# EAGLE board 12ChannelEMG (EAGLE 6.3), part 1 of 2
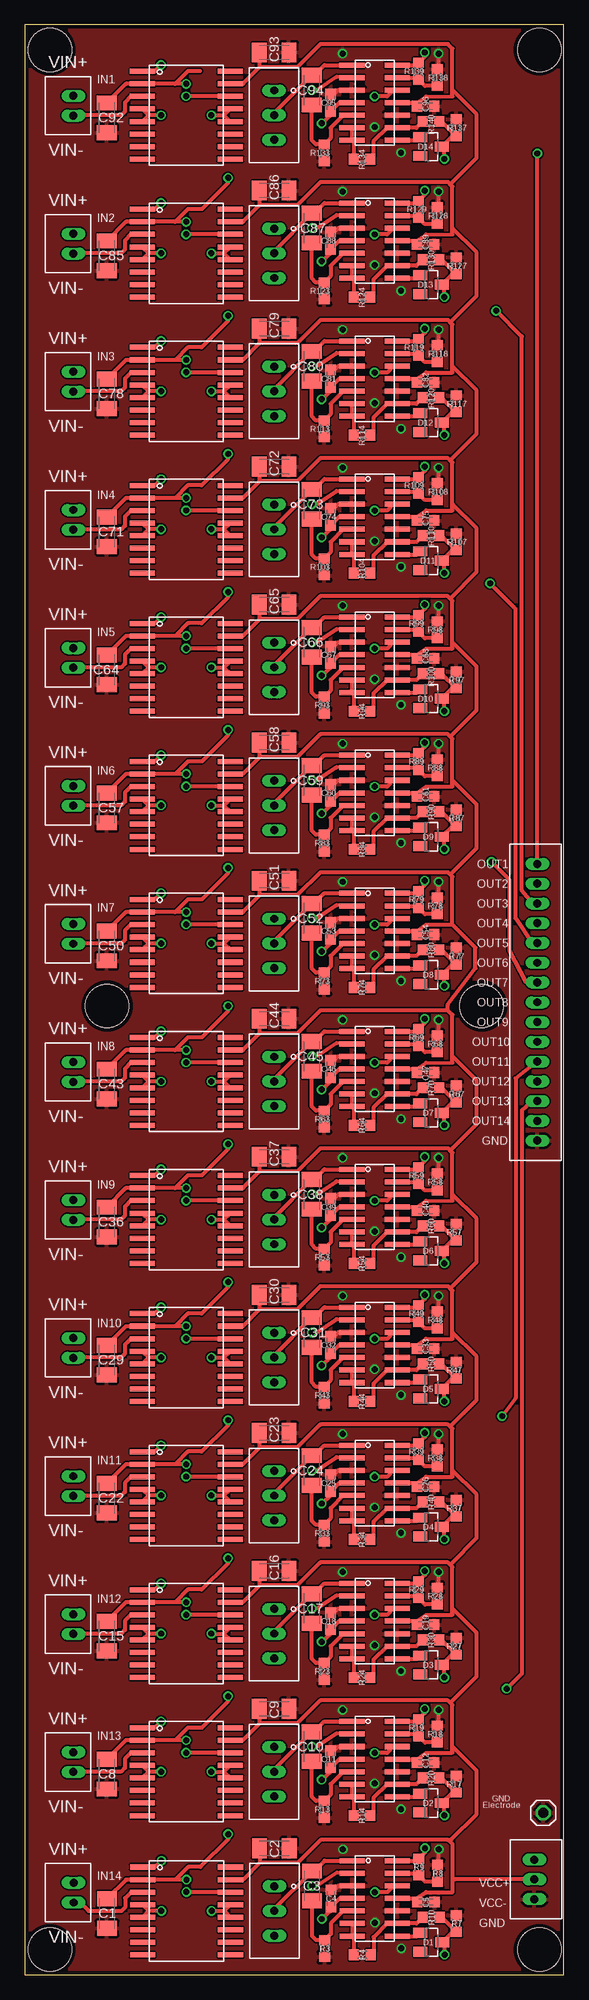
[diagram p2: board, top side]
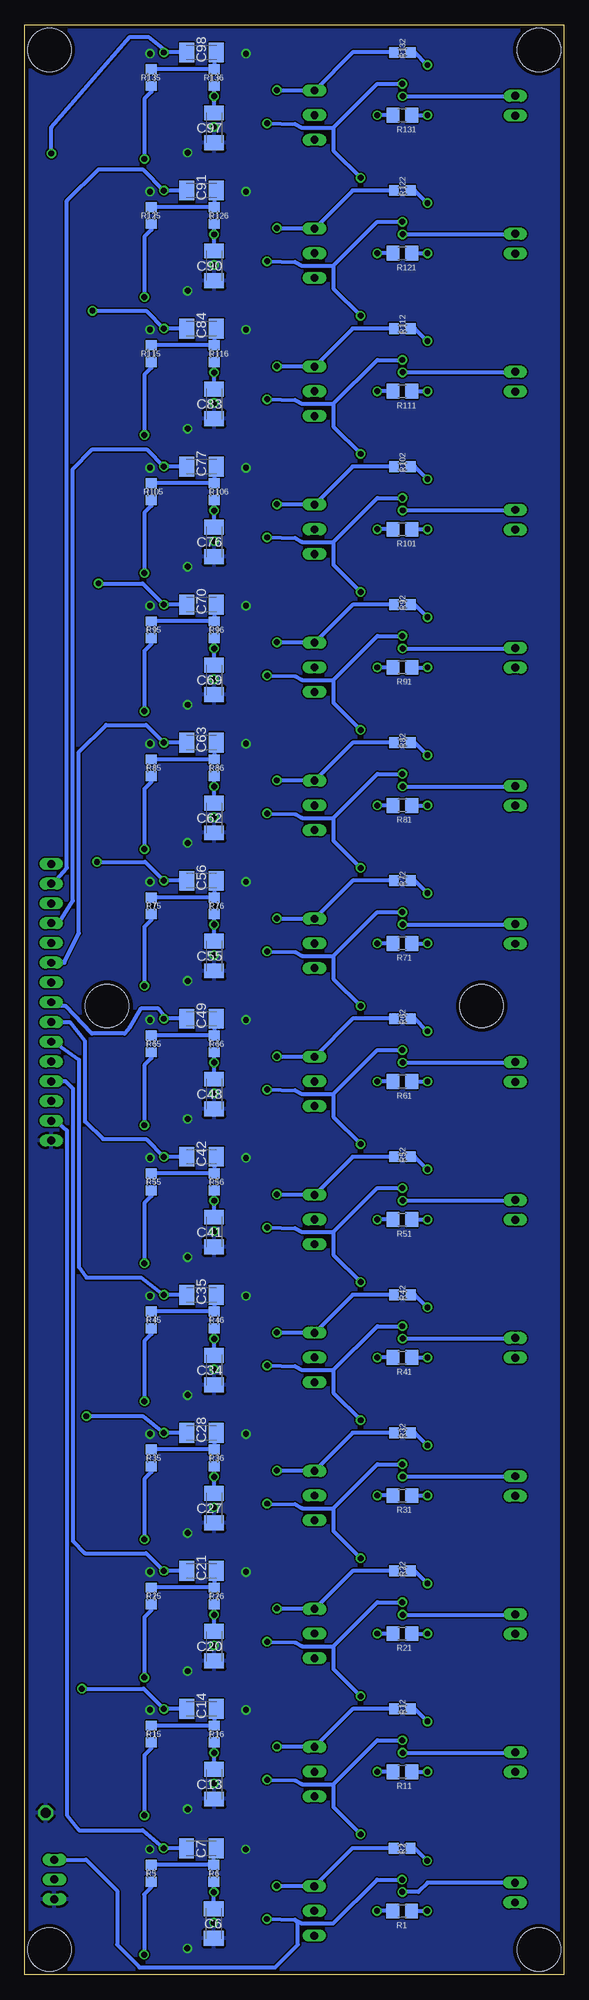
[diagram p3: board, bottom side, seen from below]

Size 54.56 x 197.36 mm. Coordinates in mm from the lower left corner, seen from the top.
Outline: 0,0 54.56,0 54.56,197.36 0,197.36 0,0
Copper layers (1*16): Top 0.0356mm / dielectric 1.5011mm / Bottom 0.0356mm
Design rules "LaenPCBOrder *": minimum track width 6mil, minimum drill 13mil, track to track 6mil, track to pad 6mil, pad to pad 6mil, via to via 6mil, smd to smd 6mil, copper to edge 15mil, drill to drill 6mil, minimum pad ring 7mil, minimum via ring 7mil, stop-mask expansion 4mil, vias tented up to drill 0mil, thermal gap 10mil
Holes 4.39 mm at 2.54,194.82 52.07,194.82 52.07,2.54 2.54,2.54 8.33,98.04 46.23,98.04

## Footprints (pad centres in the part's own frame; a part is rotated, then mirrored left to right if it is on the bottom)
C1206K = smd 1.5 x 2: 1 -1.5,0; 2 1.5,0
C0603K = smd 1.05 x 1.08: 1 -0.875,0; 2 0.875,0
SOT23 = smd 1 x 1.4: 1 -0.95,-1.1; 2 0.95,-1.1; 3 0,1.1
1X01 = drill 1.016 octagon: 1 0,0
R0805 = smd 1.3 x 1.5: 1 -0.95,0; 2 0.95,0
R0603 = smd 1 x 1.1: 1 -0.85,0; 2 0.85,0
SOIC167.5MM = smd 2.54 x 0.508: 1 -4.445,4.445; 2 -4.445,3.175; 3 -4.445,1.905; 4 -4.445,0.635; 5 -4.445,-0.635; 6 -4.445,-1.905; 7 -4.445,-3.175; 8 -4.445,-4.445; 9 4.445,-4.445; 10 4.445,-3.175; 11 4.445,-1.905; 12 4.445,-0.635; 13 4.445,0.635; 14 4.445,1.905; 15 4.445,3.175; 16 4.445,4.445
SOIC14 = smd 2.54 x 0.508: 1 -2.286,3.81; 2 -2.286,2.54; 3 -2.286,1.27; 4 -2.286,0; 5 -2.286,-1.27; 6 -2.286,-2.54; 7 -2.286,-3.81; 8 2.286,-3.81; 9 2.286,-2.54; 10 2.286,-1.27; 11 2.286,0; 12 2.286,1.27; 13 2.286,2.54; 14 2.286,3.81
PV36W = drill 0.8 long: 1 -2.5,0; 2 0,0; 3 2.5,0
2PIN = drill 0.8 long: 1 0,1; 2 0,-1
3PIN = drill 0.8 long: 1 0,2; 2 0,0; 3 0,-2
15PIN = drill 0.8 long: 1 0,14; 2 0,12; 3 0,10; 4 0,8; 5 0,6; 6 0,4; 7 0,2; 8 0,0; 9 0,-2; 10 0,-4; 11 0,-6; 12 0,-8; 13 0,-10; 14 0,-12; 15 0,-14

## Placement (x,y rotation side)
C1  0.1uF  [C1206K]  8.33,6.2 270 top
C2  0.1uF  [C1206K]  25.26,12.81 0 top
C3  3.3uF  [C1206K]  29.07,9 270 top
C4  0.22uF  [C0603K]  30.98,7.73 90 top
C5  0.22uF  [C0603K]  40.59,7.37 0 top
C6  0.1uF  [C1206K]  35.42,5.19 270 bottom
C7  0.1uF  [C1206K]  36.69,12.81 180 bottom
C8  0.1uF  [C1206K]  8.3,20.3 270 top
C9  0.1uF  [C1206K]  25.24,26.91 0 top
C10  3.3uF  [C1206K]  29.05,23.1 270 top
C11  0.22uF  [C0603K]  30.95,21.83 90 top
C12  0.22uF  [C0603K]  40.57,21.46 0 top
C13  0.1uF  [C1206K]  35.4,19.29 270 bottom
C14  0.1uF  [C1206K]  36.67,26.91 180 bottom
C15  0.1uF  [C1206K]  8.3,34.27 270 top
C16  0.1uF  [C1206K]  25.24,40.88 0 top
C17  3.3uF  [C1206K]  29.05,37.07 270 top
C18  0.22uF  [C0603K]  30.95,35.8 90 top
C19  0.22uF  [C0603K]  40.57,35.43 0 top
C20  0.1uF  [C1206K]  35.4,33.26 270 bottom
C21  0.1uF  [C1206K]  36.67,40.88 180 bottom
C22  0.1uF  [C1206K]  8.3,48.24 270 top
C23  0.1uF  [C1206K]  25.24,54.85 0 top
C24  3.3uF  [C1206K]  29.05,51.04 270 top
C25  0.22uF  [C0603K]  30.95,49.77 90 top
C26  0.22uF  [C0603K]  40.57,49.4 0 top
C27  0.1uF  [C1206K]  35.4,47.23 270 bottom
C28  0.1uF  [C1206K]  36.67,54.85 180 bottom
C29  0.1uF  [C1206K]  8.3,62.21 270 top
C30  0.1uF  [C1206K]  25.24,68.82 0 top
C31  3.3uF  [C1206K]  29.05,65.01 270 top
C32  0.22uF  [C0603K]  30.95,63.74 90 top
C33  0.22uF  [C0603K]  40.57,63.37 0 top
C34  0.1uF  [C1206K]  35.4,61.2 270 bottom
C35  0.1uF  [C1206K]  36.67,68.82 180 bottom
C36  0.1uF  [C1206K]  8.3,76.18 270 top
C37  0.1uF  [C1206K]  25.24,82.79 0 top
C38  3.3uF  [C1206K]  29.05,78.98 270 top
C39  0.22uF  [C0603K]  30.95,77.71 90 top
C40  0.22uF  [C0603K]  40.57,77.34 0 top
C41  0.1uF  [C1206K]  35.4,75.17 270 bottom
C42  0.1uF  [C1206K]  36.67,82.79 180 bottom
C43  0.1uF  [C1206K]  8.3,90.15 270 top
C44  0.1uF  [C1206K]  25.24,96.76 0 top
C45  3.3uF  [C1206K]  29.05,92.95 270 top
C46  0.22uF  [C0603K]  30.95,91.68 90 top
C47  0.22uF  [C0603K]  40.57,91.31 0 top
C48  0.1uF  [C1206K]  35.4,89.14 270 bottom
C49  0.1uF  [C1206K]  36.67,96.76 180 bottom
C50  0.1uF  [C1206K]  8.3,104.12 270 top
C51  0.1uF  [C1206K]  25.24,110.73 0 top
C52  3.3uF  [C1206K]  29.05,106.92 270 top
C53  0.22uF  [C0603K]  30.95,105.65 90 top
C54  0.22uF  [C0603K]  40.57,105.28 0 top
C55  0.1uF  [C1206K]  35.4,103.11 270 bottom
C56  0.1uF  [C1206K]  36.67,110.73 180 bottom
C57  0.1uF  [C1206K]  8.3,118.09 270 top
C58  0.1uF  [C1206K]  25.24,124.7 0 top
C59  3.3uF  [C1206K]  29.05,120.89 270 top
C60  0.22uF  [C0603K]  30.95,119.62 90 top
C61  0.22uF  [C0603K]  40.57,119.25 0 top
C62  0.1uF  [C1206K]  35.4,117.08 270 bottom
C63  0.1uF  [C1206K]  36.67,124.7 180 bottom
C64  0.1uF  [C1206K]  8.3,132.06 270 top
C65  0.1uF  [C1206K]  25.24,138.67 0 top
C66  3.3uF  [C1206K]  29.05,134.86 270 top
C67  0.22uF  [C0603K]  30.95,133.59 90 top
C68  0.22uF  [C0603K]  40.57,133.22 0 top
C69  0.1uF  [C1206K]  35.4,131.05 270 bottom
C70  0.1uF  [C1206K]  36.67,138.67 180 bottom
C71  0.1uF  [C1206K]  8.3,146.03 270 top
C72  0.1uF  [C1206K]  25.24,152.64 0 top
C73  3.3uF  [C1206K]  29.05,148.83 270 top
C74  0.22uF  [C0603K]  30.95,147.56 90 top
C75  0.22uF  [C0603K]  40.57,147.19 0 top
C76  0.1uF  [C1206K]  35.4,145.02 270 bottom
C77  0.1uF  [C1206K]  36.67,152.64 180 bottom
C78  0.1uF  [C1206K]  8.3,160 270 top
C79  0.1uF  [C1206K]  25.24,166.61 0 top
C80  3.3uF  [C1206K]  29.05,162.8 270 top
C81  0.22uF  [C0603K]  30.95,161.53 90 top
C82  0.22uF  [C0603K]  40.57,161.16 0 top
C83  0.1uF  [C1206K]  35.4,158.99 270 bottom
C84  0.1uF  [C1206K]  36.67,166.61 180 bottom
C85  0.1uF  [C1206K]  8.3,173.97 270 top
C86  0.1uF  [C1206K]  25.24,180.58 0 top
C87  3.3uF  [C1206K]  29.05,176.77 270 top
C88  0.22uF  [C0603K]  30.95,175.5 90 top
C89  0.22uF  [C0603K]  40.57,175.13 0 top
C90  0.1uF  [C1206K]  35.4,172.96 270 bottom
C91  0.1uF  [C1206K]  36.67,180.58 180 bottom
C92  0.1uF  [C1206K]  8.3,187.94 270 top
C93  0.1uF  [C1206K]  25.24,194.55 0 top
C94  3.3uF  [C1206K]  29.05,190.74 270 top
C95  0.22uF  [C0603K]  30.95,189.47 90 top
C96  0.22uF  [C0603K]  40.57,189.1 0 top
C97  0.1uF  [C1206K]  35.4,186.93 270 bottom
C98  0.1uF  [C1206K]  36.67,194.55 180 bottom
D1  BAT54  [SOT23]  41.14,3.29 270 top
D2  BAT54  [SOT23]  41.11,17.38 270 top
D3  BAT54  [SOT23]  41.11,31.35 270 top
D4  BAT54  [SOT23]  41.11,45.32 270 top
D5  BAT54  [SOT23]  41.11,59.29 270 top
D6  BAT54  [SOT23]  41.11,73.26 270 top
D7  BAT54  [SOT23]  41.11,87.23 270 top
D8  BAT54  [SOT23]  41.11,101.2 270 top
D9  BAT54  [SOT23]  41.11,115.17 270 top
D10  BAT54  [SOT23]  41.11,129.14 270 top
D11  BAT54  [SOT23]  41.11,143.11 270 top
D12  BAT54  [SOT23]  41.11,157.08 270 top
D13  BAT54  [SOT23]  41.11,171.05 270 top
D14  BAT54  [SOT23]  41.11,185.02 270 top
GND  GND  [1X01]  52.45,16.38 0 top
R1  50k  [R0805]  16.37,6.46 180 bottom
R2  100  [R0603]  16.37,12.81 180 bottom
R3  10k  [R0603]  30.34,2.65 90 top
R4  200  [R0603]  34.15,2.02 0 top
R5  82k  [R0603]  41.77,10.27 90 bottom
R6  82k  [R0603]  35.42,10.27 90 bottom
R7  300  [R0603]  43.68,5.19 90 top
R8  100k  [R0603]  41.77,10.27 90 top
R9  56k  [R0603]  39.87,10.91 90 top
R10  100  [R0603]  41.14,5.83 0 top
R11  50k  [R0805]  16.35,20.56 180 bottom
R12  100  [R0603]  16.35,26.91 180 bottom
R13  10k  [R0603]  30.32,16.75 90 top
R14  200  [R0603]  34.13,16.11 0 top
R15  82k  [R0603]  41.75,24.37 90 bottom
R16  82k  [R0603]  35.4,24.37 90 bottom
R17  300  [R0603]  43.65,19.29 90 top
R18  100k  [R0603]  41.75,24.37 90 top
R19  56k  [R0603]  39.84,25 90 top
R20  100  [R0603]  41.11,19.92 0 top
R21  50k  [R0805]  16.35,34.53 180 bottom
R22  100  [R0603]  16.35,40.88 180 bottom
R23  10k  [R0603]  30.32,30.72 90 top
R24  200  [R0603]  34.13,30.08 0 top
R25  82k  [R0603]  41.75,38.34 90 bottom
R26  82k  [R0603]  35.4,38.34 90 bottom
R27  300  [R0603]  43.65,33.26 90 top
R28  100k  [R0603]  41.75,38.34 90 top
R29  56k  [R0603]  39.84,38.97 90 top
R30  100  [R0603]  41.11,33.89 0 top
R31  50k  [R0805]  16.35,48.5 180 bottom
R32  100  [R0603]  16.35,54.85 180 bottom
R33  10k  [R0603]  30.32,44.69 90 top
R34  200  [R0603]  34.13,44.05 0 top
R35  82k  [R0603]  41.75,52.31 90 bottom
R36  82k  [R0603]  35.4,52.31 90 bottom
R37  300  [R0603]  43.65,47.23 90 top
R38  100k  [R0603]  41.75,52.31 90 top
R39  56k  [R0603]  39.84,52.94 90 top
R40  100  [R0603]  41.11,47.86 0 top
R41  50k  [R0805]  16.35,62.47 180 bottom
R42  100  [R0603]  16.35,68.82 180 bottom
R43  10k  [R0603]  30.32,58.66 90 top
R44  200  [R0603]  34.13,58.02 0 top
R45  82k  [R0603]  41.75,66.28 90 bottom
R46  82k  [R0603]  35.4,66.28 90 bottom
R47  300  [R0603]  43.65,61.2 90 top
R48  100k  [R0603]  41.75,66.28 90 top
R49  56k  [R0603]  39.84,66.91 90 top
R50  100  [R0603]  41.11,61.83 0 top
R51  50k  [R0805]  16.35,76.44 180 bottom
R52  100  [R0603]  16.35,82.79 180 bottom
R53  10k  [R0603]  30.32,72.63 90 top
R54  200  [R0603]  34.13,71.99 0 top
R55  82k  [R0603]  41.75,80.25 90 bottom
R56  82k  [R0603]  35.4,80.25 90 bottom
R57  300  [R0603]  43.65,75.17 90 top
R58  100k  [R0603]  41.75,80.25 90 top
R59  56k  [R0603]  39.84,80.88 90 top
R60  100  [R0603]  41.11,75.8 0 top
R61  50k  [R0805]  16.35,90.41 180 bottom
R62  100  [R0603]  16.35,96.76 180 bottom
R63  10k  [R0603]  30.32,86.6 90 top
R64  200  [R0603]  34.13,85.96 0 top
R65  82k  [R0603]  41.75,94.22 90 bottom
R66  82k  [R0603]  35.4,94.22 90 bottom
R67  300  [R0603]  43.65,89.14 90 top
R68  100k  [R0603]  41.75,94.22 90 top
R69  56k  [R0603]  39.84,94.85 90 top
R70  100  [R0603]  41.11,89.77 0 top
R71  50k  [R0805]  16.35,104.38 180 bottom
R72  100  [R0603]  16.35,110.73 180 bottom
R73  10k  [R0603]  30.32,100.57 90 top
R74  200  [R0603]  34.13,99.93 0 top
R75  82k  [R0603]  41.75,108.19 90 bottom
R76  82k  [R0603]  35.4,108.19 90 bottom
R77  300  [R0603]  43.65,103.11 90 top
R78  100k  [R0603]  41.75,108.19 90 top
R79  56k  [R0603]  39.84,108.82 90 top
R80  100  [R0603]  41.11,103.74 0 top
R81  50k  [R0805]  16.35,118.35 180 bottom
R82  100  [R0603]  16.35,124.7 180 bottom
R83  10k  [R0603]  30.32,114.54 90 top
R84  200  [R0603]  34.13,113.9 0 top
R85  82k  [R0603]  41.75,122.16 90 bottom
R86  82k  [R0603]  35.4,122.16 90 bottom
R87  300  [R0603]  43.65,117.08 90 top
R88  100k  [R0603]  41.75,122.16 90 top
R89  56k  [R0603]  39.84,122.79 90 top
R90  100  [R0603]  41.11,117.71 0 top
R91  50k  [R0805]  16.35,132.32 180 bottom
R92  100  [R0603]  16.35,138.67 180 bottom
R93  10k  [R0603]  30.32,128.51 90 top
R94  200  [R0603]  34.13,127.87 0 top
R95  82k  [R0603]  41.75,136.13 90 bottom
R96  82k  [R0603]  35.4,136.13 90 bottom
R97  300  [R0603]  43.65,131.05 90 top
R98  100k  [R0603]  41.75,136.13 90 top
R99  56k  [R0603]  39.84,136.76 90 top
R100  100  [R0603]  41.11,131.68 0 top
R101  50k  [R0805]  16.35,146.29 180 bottom
R102  100  [R0603]  16.35,152.64 180 bottom
R103  10k  [R0603]  30.32,142.48 90 top
R104  200  [R0603]  34.13,141.84 0 top
R105  82k  [R0603]  41.75,150.1 90 bottom
R106  82k  [R0603]  35.4,150.1 90 bottom
R107  300  [R0603]  43.65,145.02 90 top
R108  100k  [R0603]  41.75,150.1 90 top
R109  56k  [R0603]  39.84,150.73 90 top
R110  100  [R0603]  41.11,145.65 0 top
R111  50k  [R0805]  16.35,160.26 180 bottom
R112  100  [R0603]  16.35,166.61 180 bottom
R113  10k  [R0603]  30.32,156.45 90 top
R114  200  [R0603]  34.13,155.81 0 top
R115  82k  [R0603]  41.75,164.07 90 bottom
R116  82k  [R0603]  35.4,164.07 90 bottom
R117  300  [R0603]  43.65,158.99 90 top
R118  100k  [R0603]  41.75,164.07 90 top
R119  56k  [R0603]  39.84,164.7 90 top
R120  100  [R0603]  41.11,159.62 0 top
R121  50k  [R0805]  16.35,174.23 180 bottom
R122  100  [R0603]  16.35,180.58 180 bottom
R123  10k  [R0603]  30.32,170.42 90 top
R124  200  [R0603]  34.13,169.78 0 top
R125  82k  [R0603]  41.75,178.04 90 bottom
R126  82k  [R0603]  35.4,178.04 90 bottom
R127  300  [R0603]  43.65,172.96 90 top
R128  100k  [R0603]  41.75,178.04 90 top
R129  56k  [R0603]  39.84,178.67 90 top
R130  100  [R0603]  41.11,173.59 0 top
R131  50k  [R0805]  16.35,188.2 180 bottom
R132  100  [R0603]  16.35,194.55 180 bottom
R133  10k  [R0603]  30.32,184.39 90 top
R134  200  [R0603]  34.13,183.75 0 top
R135  82k  [R0603]  41.75,192.01 90 bottom
R136  82k  [R0603]  35.4,192.01 90 bottom
R137  300  [R0603]  43.65,186.93 90 top
R138  100k  [R0603]  41.75,192.01 90 top
R139  56k  [R0603]  39.84,192.64 90 top
R140  100  [R0603]  41.11,187.56 0 top
U$1  INA101KU  [SOIC167.5MM]  16.37,6.46 0 top
U$2  LMC6492  [SOIC14]  35.42,7.73 0 top
U$3  PV36504  [PV36W]  25.26,6.46 270 top
U$4  INA101KU  [SOIC167.5MM]  16.35,20.56 0 top
U$5  LMC6492  [SOIC14]  35.4,21.83 0 top
U$6  PV36504  [PV36W]  25.24,20.56 270 top
U$7  2PIN  [2PIN]  4.93,21.53 0 top
U$8  INA101KU  [SOIC167.5MM]  16.35,34.53 0 top
U$9  LMC6492  [SOIC14]  35.4,35.8 0 top
U$10  2PIN  [2PIN]  4.95,8.32 0 top
U$11  PV36504  [PV36W]  25.24,34.53 270 top
U$12  2PIN  [2PIN]  4.93,35.5 0 top
U$13  INA101KU  [SOIC167.5MM]  16.35,48.5 0 top
U$14  LMC6492  [SOIC14]  35.4,49.77 0 top
U$15  PV36504  [PV36W]  25.24,48.5 270 top
U$16  2PIN  [2PIN]  4.93,49.47 0 top
U$17  INA101KU  [SOIC167.5MM]  16.35,62.47 0 top
U$18  LMC6492  [SOIC14]  35.4,63.74 0 top
U$19  PV36504  [PV36W]  25.24,62.47 270 top
U$20  2PIN  [2PIN]  4.93,63.44 0 top
U$21  INA101KU  [SOIC167.5MM]  16.35,76.44 0 top
U$22  LMC6492  [SOIC14]  35.4,77.71 0 top
U$23  PV36504  [PV36W]  25.24,76.44 270 top
U$24  2PIN  [2PIN]  4.93,77.41 0 top
U$25  INA101KU  [SOIC167.5MM]  16.35,90.41 0 top
U$26  LMC6492  [SOIC14]  35.4,91.68 0 top
U$27  PV36504  [PV36W]  25.24,90.41 270 top
U$28  2PIN  [2PIN]  4.93,91.38 0 top
U$29  INA101KU  [SOIC167.5MM]  16.35,104.38 0 top
U$30  LMC6492  [SOIC14]  35.4,105.65 0 top
U$31  PV36504  [PV36W]  25.24,104.38 270 top
U$32  2PIN  [2PIN]  4.93,105.35 0 top
U$33  INA101KU  [SOIC167.5MM]  16.35,118.35 0 top
U$34  LMC6492  [SOIC14]  35.4,119.62 0 top
U$35  PV36504  [PV36W]  25.24,118.35 270 top
U$36  2PIN  [2PIN]  4.93,119.32 0 top
U$37  INA101KU  [SOIC167.5MM]  16.35,132.32 0 top
U$38  LMC6492  [SOIC14]  35.4,133.59 0 top
U$39  PV36504  [PV36W]  25.24,132.32 270 top
U$40  2PIN  [2PIN]  4.93,133.29 0 top
U$41  INA101KU  [SOIC167.5MM]  16.35,146.29 0 top
U$42  LMC6492  [SOIC14]  35.4,147.56 0 top
U$43  PV36504  [PV36W]  25.24,146.29 270 top
U$44  2PIN  [2PIN]  4.93,147.26 0 top
U$45  INA101KU  [SOIC167.5MM]  16.35,160.26 0 top
U$46  LMC6492  [SOIC14]  35.4,161.53 0 top
U$47  PV36504  [PV36W]  25.24,160.26 270 top
U$48  2PIN  [2PIN]  4.93,161.23 0 top
U$49  INA101KU  [SOIC167.5MM]  16.35,174.23 0 top
U$50  LMC6492  [SOIC14]  35.4,175.5 0 top
U$51  PV36504  [PV36W]  25.24,174.23 270 top
U$52  2PIN  [2PIN]  4.93,175.2 0 top
U$53  INA101KU  [SOIC167.5MM]  16.35,188.2 0 top
U$54  LMC6492  [SOIC14]  35.4,189.47 0 top
U$55  PV36504  [PV36W]  25.24,188.2 270 top
U$56  2PIN  [2PIN]  4.93,189.17 0 top
U$57  3PIN  [3PIN]  51.56,9.65 180 top
U$58  15PIN  [15PIN]  51.87,98.42 0 top